# Altium project controller.PrjPcb
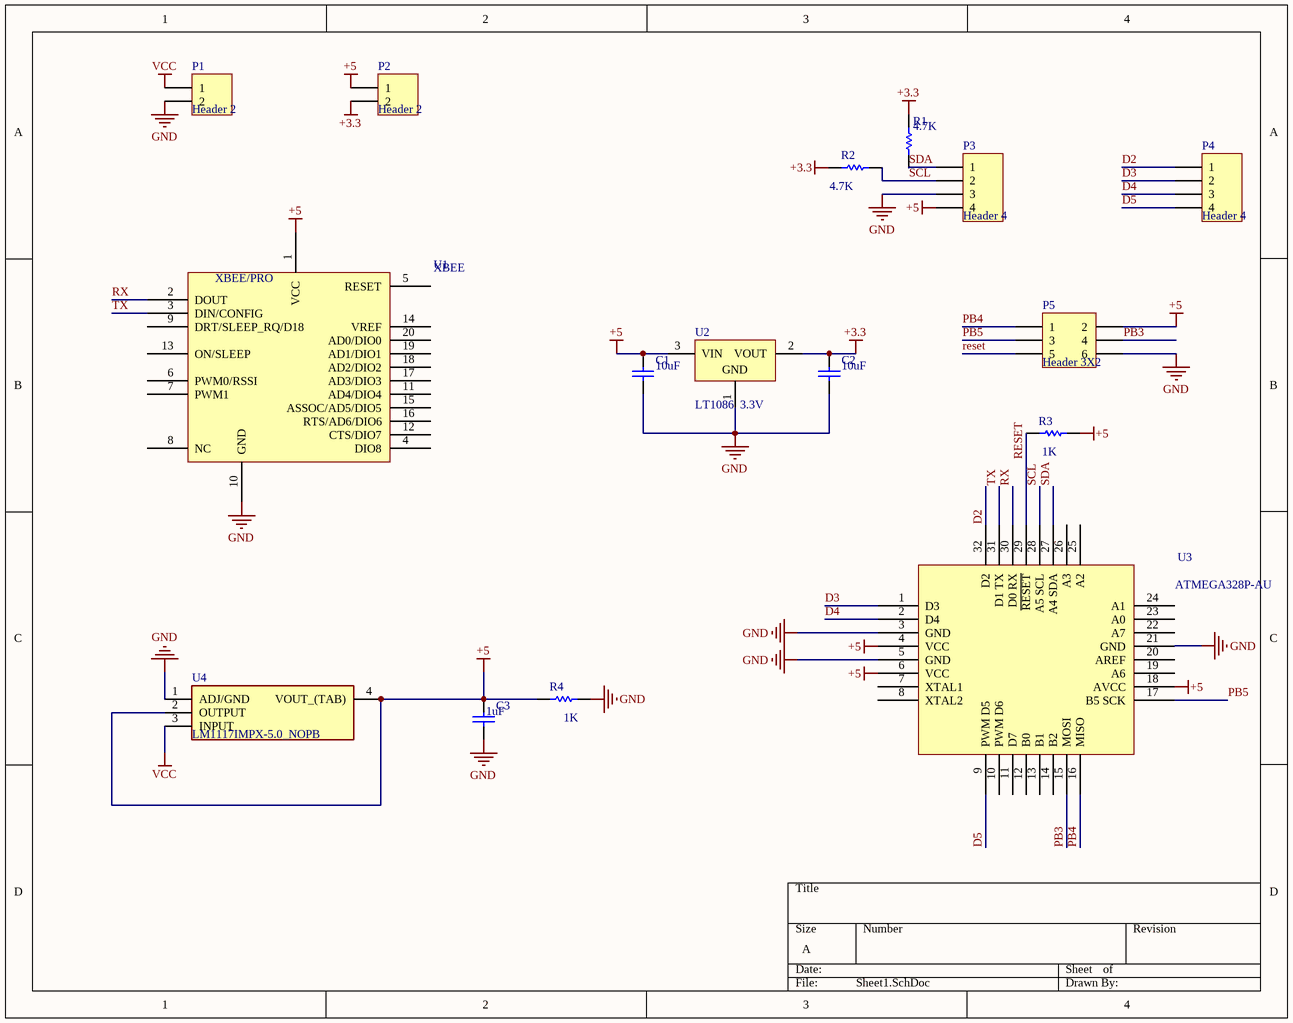
[diagram p0: Sheet1.SchDoc]
1 sheet, 16 parts. Net scope: global (net labels, ports and power ports of the same name join across sheets).
Board file: PCB1.PcbDoc

## Sheet Sheet1.SchDoc
size A

### Parts
C1  value 10uF  [C0805]  (hidden comment: Cap)
C2  value 10uF  [C0805]  (hidden comment: Cap)
C3  value 1uF  [C0805]  (hidden comment: Cap)
P1  Header 2  [HDR1X2]
P2  Header 2  [HDR1X2]
P3  Header 4  [HDR1X4]
P4  Header 4  [HDR1X4]
P5  Header 3X2  [HDR2X3]
R1  value 4.7K  [C0805]  (hidden comment: Res1)
R2  value 4.7K  [C0805]  (hidden comment: Res1)
R3  value 1K  [C0805]  (hidden comment: Res1)
R4  value 1K  [C0805]  (hidden comment: Res1)
U1  XBEE  [XBEE/PRO]
U2  LT1086  3.3V  [TO-220]
U3  ATMEGA328P-AU  [TQFP80P900X900X120-32N]
U4  LM1117IMPX-5.0_NOPB  [SOT230P700X180-4N]

### Nets
+3.3: C2.1 P2.2 R1.1 R2.2 U2.2(VOUT)
+5: C1.1 C3.2 P2.1 P3.4 P5.2 R3.2 R4.1 U1.1(VCC) U2.3(VIN) U3.4(VCC) U3.6(VCC) U3.18(AVCC) U4.2(OUTPUT) U4.4(VOUT_(TAB))
GND: C1.2 C2.2 C3.1 P1.2 P3.3 P5.6 R4.2 U1.10(GND) U2.1(GND) U3.3(GND) U3.5(GND) U3.21(GND) U4.1(ADJ/GND)
VCC: P1.1 U4.3(INPUT)
D2: P4.1 U3.32(D2)
D3: P4.2 U3.1(D3)
D4: P4.3 U3.2(D4)
D5: P4.4 U3.9(PWM_D5)
PB3: P5.4 U3.15(MOSI)
PB4: P5.1 U3.16(MISO)
PB5: P5.3 U3.17(B5_SCK)
reset: P5.5 R3.1 U3.29(~{RESET})
RX: U1.2(DOUT) U3.30(D0_RX)
SCL: P3.2 R2.1 U3.28(A5_SCL)
SDA: P3.1 R1.2 U3.27(A4_SDA)
TX: U1.3(DIN/CONFIG) U3.31(D1_TX)

Not connected (* = marked no-connect by the designer): U1 4(DIO8) 5(RESET) 6(PWM0/RSSI) 7(PWM1) 8(NC) 9(DRT/SLEEP_RQ/D18) 11(AD4/DIO4) 12(CTS/DIO7) 13(ON/SLEEP) 14(VREF) 15(ASSOC/AD5/DIO5) 16(RTS/AD6/DIO6) 17(AD3/DIO3) 18(AD2/DIO2) 19(AD1/DIO1) 20(AD0/DIO0); U3 7(XTAL1) 8(XTAL2) 10(PWM_D6) 11(D7) 12(B0) 13(B1) 14(B2) 19(A6) 20(AREF) 22(A7) 23(A0) 24(A1) 25(A2) 26(A3)

### Notes on the sheet
- (in symbol XBEE) XBEE/PRO

### Library data of the parts
C1-C3 = Cap: Capacitor; Published: 8-Jun-2000; LatestRevisionDate: 17-Jul-2002; LatestRevisionNote: Re-released for DXP Platform.; PackageReference: RAD-0.3; Publisher: Altium Limited; PackageDescription: Radial Cap, Thru-Hole; 2 Leads; 0.3 in Pin Spacing
P1 P2 = Header 2: Header, 2-Pin; LatestRevisionDate: 17-Jul-2002; LatestRevisionNote: Re-released for DXP Platform.; Publisher: Altium Limited
P3 P4 = Header 4: Header, 4-Pin; LatestRevisionDate: 17-Jul-2002; LatestRevisionNote: Re-released for DXP Platform.; Publisher: Altium Limited
P5 = Header 3X2: Header, 3-Pin, Dual row; LatestRevisionDate: 17-Jul-2002; LatestRevisionNote: Re-released for DXP Platform.; Publisher: Altium Limited
R1-R4 = Res1: Resistor; Published: 8-Jun-2000; LatestRevisionDate: 17-Jul-2002; LatestRevisionNote: Re-released for DXP Platform.; PackageReference: AXIAL-0.3; Publisher: Altium Limited; PackageDescription: Axial Device, Thru-Hole; 2 Leads; 0.3 in Pin Spacing
U3 = ATMEGA328P-AU: Microchip Technology ATMEGA328P-AN, 8bit AVR Microcontroller, 20MHz, 32 kB Flash, 32-Pin TQFP; Company: Gueni; Created By: Mohamed Gueni; Date: 20 October 2018; RS Stock No: 131-0271; Datasheet URL: https://docs-emea.rs-online.com/webdocs/15b8/0900766b815b8e7b.pdf
U4 = LM1117IMPX-5.0_NOPB: Undefined or Miscellaneous; Manufacturer_Name: Texas Instruments; Manufacturer_Part_Number: LM1117IMPX-5.0/NOPB; Datasheet Link: http://www.ti.com/lit/gpn/lm1117; Height: 1.8mm; Mouser2 Part Number: 926-LM1117IMPX50NOPB; Mouser2 Price/Stock: https://www.mouser.com/Search/Refine.aspx?Keyword=926-LM1117IMPX50NOPB